# Altium schematic sheet alcotest.SchDoc
size A3
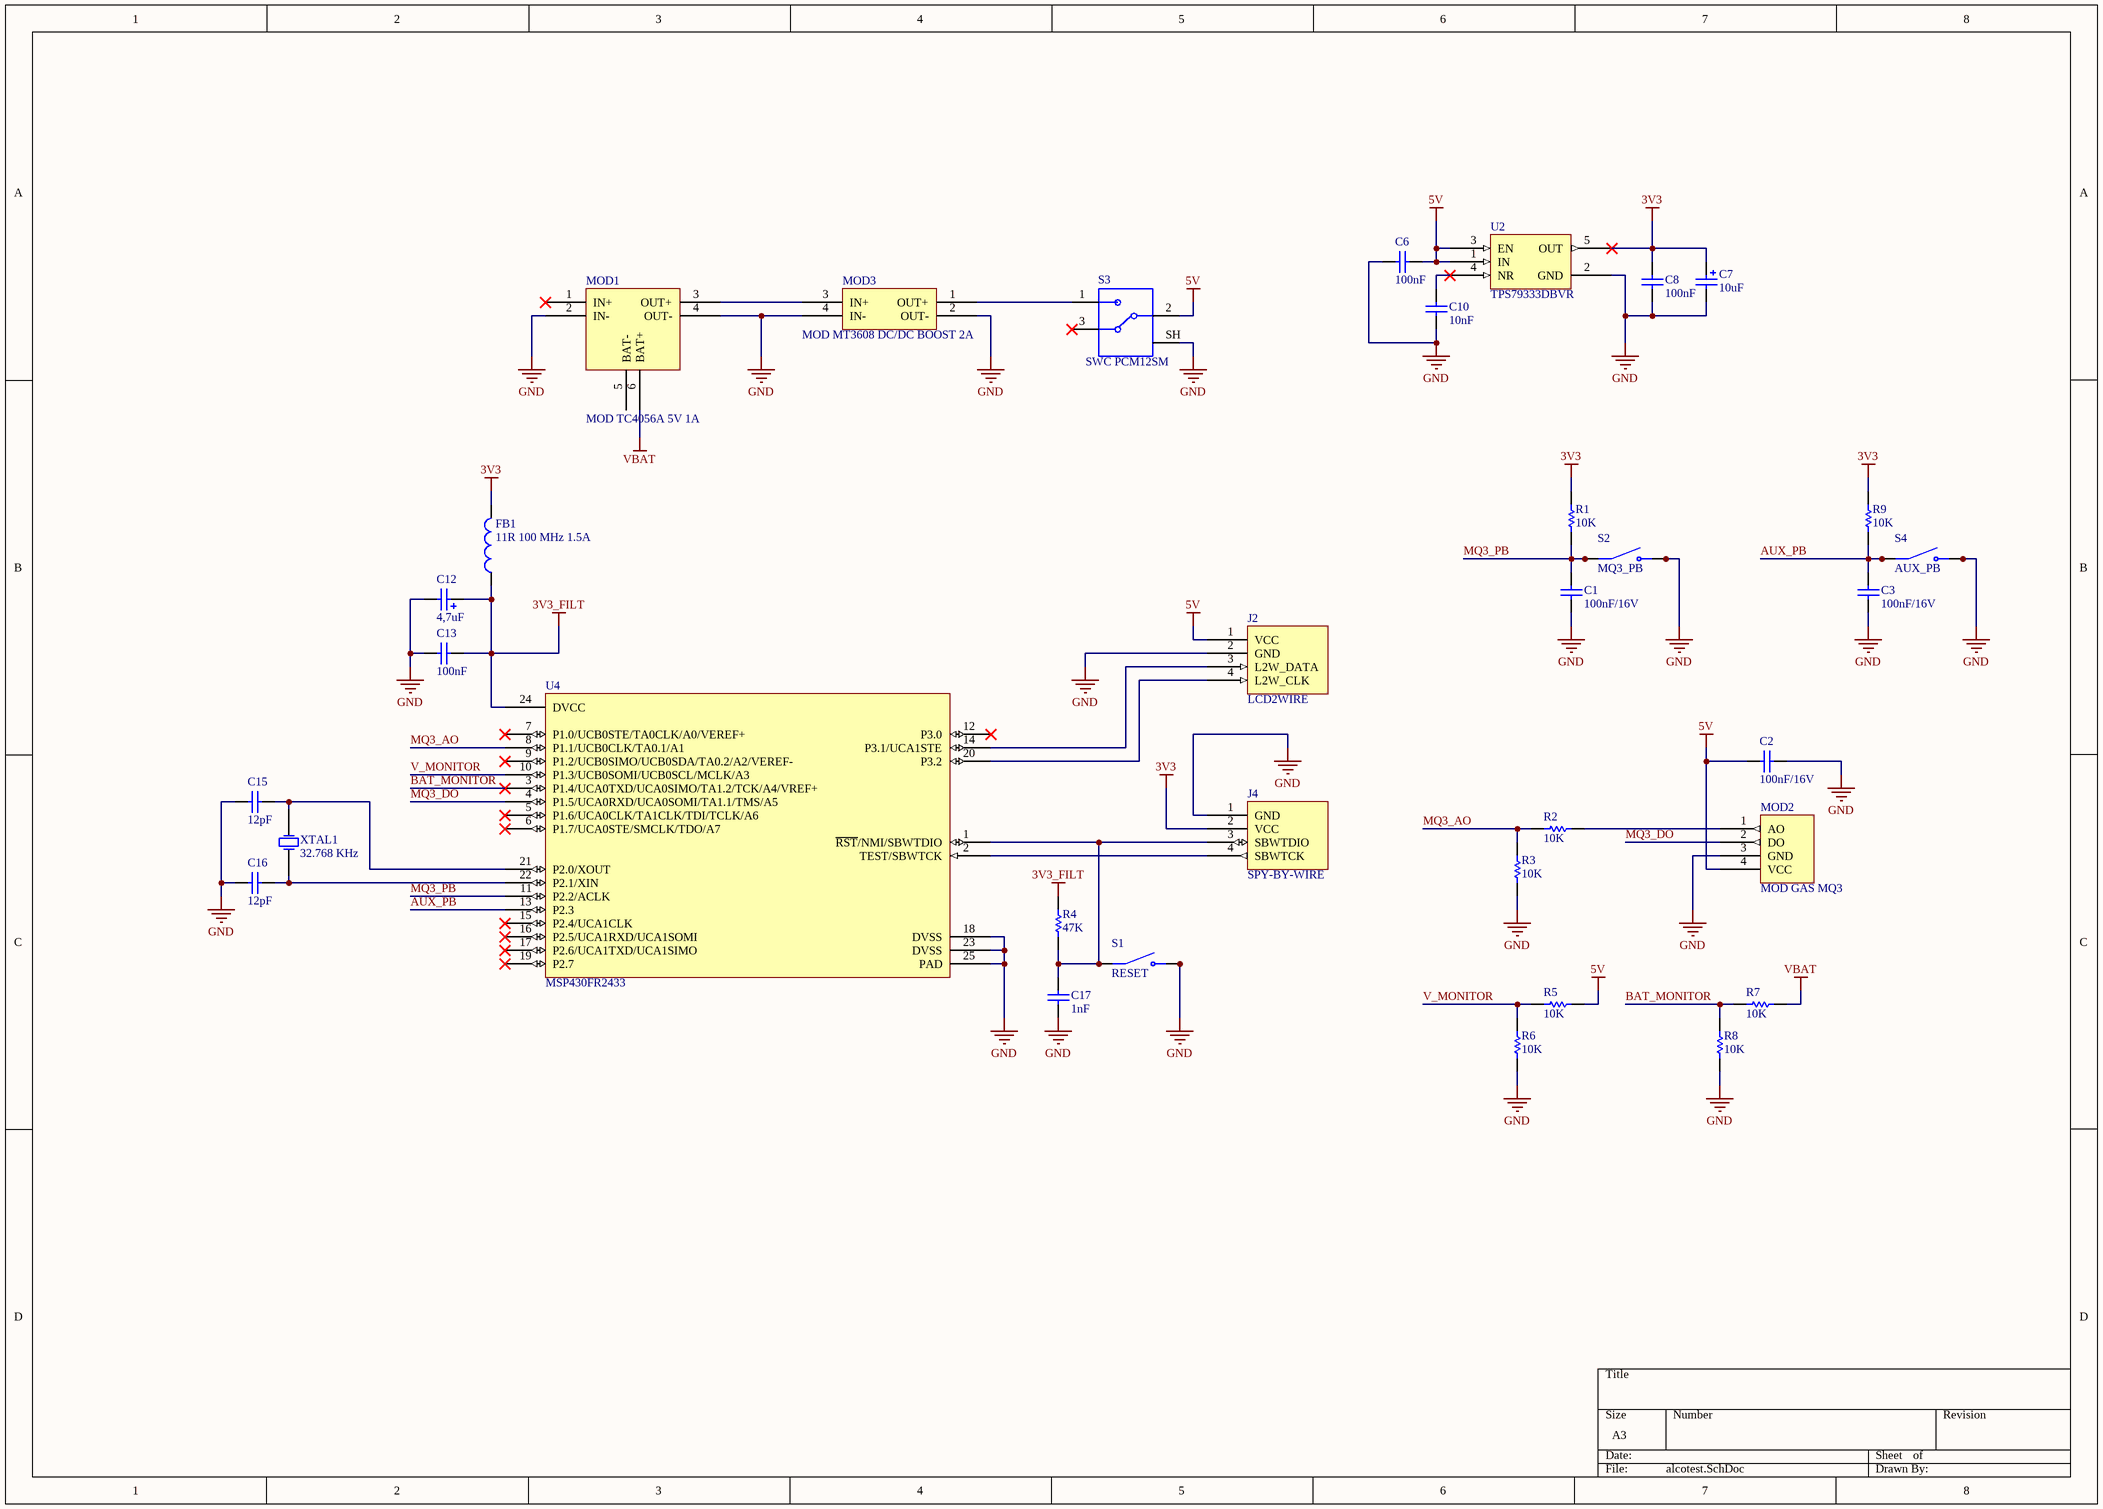
[diagram p0: alcotest.SchDoc]

## Parts
C1  100nF/16V  [SMD 0603 GENERIC]
C2  100nF/16V  [SMD 0603 GENERIC]
C3  100nF/16V  [SMD 0603 GENERIC]
C6  100nF  [SMD 0603 GENERIC]
C7  10uF  [SMD 1206 POLARIZED]
C8  100nF  [SMD 0603 GENERIC]
C10  10nF  [SMD 0603 GENERIC]
C12  4,7uF  [SMD 1206 POLARIZED]
C13  100nF  [SMD 0603 GENERIC]
C15  12pF  [SMD 0603 GENERIC]
C16  12pF  [SMD 0603 GENERIC]
C17  1nF  [SMD 0603 GENERIC]
FB1  11R 100 MHz 1.5A  [SMD 0805 GENERIC]
J2  LCD2WIRE  [THT CON 4-PIN 2.54 WHITE]
J4  SPY-BY-WIRE  [THT CON 4-PIN 2.54 WHITE]
MOD1  MOD TC4056A 5V 1A  [THT MOD TC4056A 5V 1A]
MOD2  MOD GAS MQ3  [THT MOD MQ3]
MOD3  MOD MT3608 DC/DC BOOST 2A  [THT MOD MT3608 DC/DC BOOST CONV 2A]
R1  10K  [SMD 0603 GENERIC]
R2  10K  [SMD 0603 GENERIC]
R3  10K  [SMD 0603 GENERIC]
R4  47K  [SMD 0603 GENERIC]
R5  10K  [SMD 0603 GENERIC]
R6  10K  [SMD 0603 GENERIC]
R7  10K  [SMD 0603 GENERIC]
R8  10K  [SMD 0603 GENERIC]
R9  10K  [SMD 0603 GENERIC]
S1  RESET  [THT SWC OMRON B3F-1022]
S2  MQ3_PB  [THT SWC OMRON B3F-1022]
S3  SWC PCM12SM  [SMD SWC PCM12]
S4  AUX_PB  [THT SWC OMRON B3F-1022]
U2  TPS79333DBVR  [SOT23-5]
U4  MSP430FR2433  [VQFN-24]
XTAL1  32.768 KHz  [SMD-2 XTAL ABRACON]

## Nets
3V3: C7.1 C8.2 FB1.2 J4.2(VCC) R1.2 R9.2 U2.5(OUT)
3V3_FILT: C12.1 C13.2 FB1.1 R4.2 U4.24(DVCC)
5V: C2.2 C6.2 J2.1(VCC) MOD2.4(VCC) R5.1 S3.2 U2.1(IN) U2.3(EN)
GND: C1.1 C2.1 C3.1 C6.1 C7.2 C8.1 C10.1 C12.2 C13.1 C15.1 C16.1 C17.1 J2.2(GND) J4.1(GND) MOD1.2(IN-) MOD1.4(OUT-) MOD2.3(GND) MOD3.2(OUT-) MOD3.4(IN-) R3.2 R6.2 R8.2 S1.3(NO) S1.4(NO) S2.3(NO) S2.4(NO) S3.SH S4.3(NO) S4.4(NO) U2.2(GND) U4.18(DVSS) U4.23(DVSS) U4.25(PAD)
VBAT: MOD1.6(BAT+) R7.1
AUX_PB: C3.2 R9.1 S4.1(COM) S4.2(COM) U4.13(P2.3)
BAT_MONITOR: R7.2 R8.1 U4.3(P1.4/UCA0TXD/UCA0SIMO/TA1.2/TCK/A4/VREF+)
MQ3_AO: R2.2 R3.1 U4.8(P1.1/UCB0CLK/TA0.1/A1)
MQ3_DO: MOD2.2(DO) U4.4(P1.5/UCA0RXD/UCA0SOMI/TA1.1/TMS/A5)
MQ3_PB: C1.2 R1.1 S2.1(COM) S2.2(COM) U4.11(P2.2/ACLK)
V_MONITOR: R5.2 R6.1 U4.10(P1.3/UCB0SOMI/UCB0SCL/MCLK/A3)
NetC10_2: C10.2 U2.4(NR)
NetC15_2: C15.2 U4.21(P2.0/XOUT) XTAL1.2(OSC2)
NetC16_2: C16.2 U4.22(P2.1/XIN) XTAL1.1(OSC1)
NetC17_2: C17.2 J4.3(SBWTDIO) R4.1 S1.1(COM) S1.2(COM) U4.1(~{RST}/NMI/SBWTDIO)
NetJ2_3: J2.3(L2W_DATA) U4.14(P3.1/UCA1STE)
NetJ2_4: J2.4(L2W_CLK) U4.20(P3.2)
NetJ4_4: J4.4(SBWTCK) U4.2(TEST/SBWTCK)
NetMOD1_3: MOD1.3(OUT+) MOD3.3(IN+)
NetMOD2_1: MOD2.1(AO) R2.1
NetMOD3_1: MOD3.1(OUT+) S3.1

Not connected (* = marked no-connect by the designer): MOD1 1(IN+)* 5(BAT-); S3 3*; U4 5(P1.6/UCA0CLK/TA1CLK/TDI/TCLK/A6)* 6(P1.7/UCA0STE/SMCLK/TDO/A7)* 7(P1.0/UCB0STE/TA0CLK/A0/VEREF+)* 9(P1.2/UCB0SIMO/UCB0SDA/TA0.2/A2/VEREF-)* 12(P3.0)* 15(P2.4/UCA1CLK)* 16(P2.5/UCA1RXD/UCA1SOMI)* 17(P2.6/UCA1TXD/UCA1SIMO)* 19(P2.7)*

## Library data of the parts
C1-C3 C6 C8 C13 = CAP SMD CER 100nF 16V 10% X7R 0603
C7 = CAP SMD TAN 10uF 16V 10% 1206
C10 = CAP SMD CER 10nF 16V 10% X7R 0603
C12 = CAP SMD TAN 4,7uF 35V 10% 1206
C15 C16 = CAP SMD CER 12pF 25V 10% C0G 0603
C17 = CAP SMD CER 1nF 16V 10% X7R 0603
FB1 = FBD SMD 11R 100MHz 1.5A 0805
J2 = CON THT LCD2WIRE 4-PIN 2.54
J4 = CON THT SPY-BY-WIRE 4-PIN 2.54
R1-R3 R5-R9 = RES SMD 10K 1% 0603
R4 = RES SMD 47K 1% 0603
S1 S2 S4 = SWC OMRON B3F-1022
U2 = PWR TPS79333DBVR
U4 = MCU MSP430FR2433IRGET
XTAL1 = XTAL SMD 32.768 KHz ABRACON